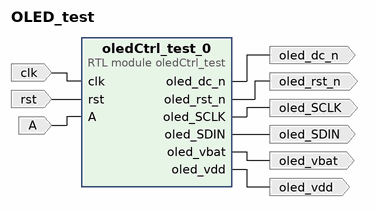
[diagram p0: block diagram of the top level]
# Vivado block design OLED_test, xc7z020clg484-1, Vivado 2020.2
create_bd_design OLED_test

create_bd_port -dir I -type clk clk
create_bd_port -dir I -type rst rst
create_bd_port -dir I A
create_bd_port -dir O oled_SCLK
create_bd_port -dir O oled_SDIN
create_bd_port -dir O oled_dc_n
create_bd_port -dir O -type rst oled_rst_n
create_bd_port -dir O oled_vbat
create_bd_port -dir O oled_vdd

create_bd_cell -type module -reference oledCtrl_test oledCtrl_test_0

# ---- connections ----

connect_bd_net -net clk_0_1 [get_bd_ports clk] [get_bd_pins oledCtrl_test_0/clk]
connect_bd_net -net rst_0_1 [get_bd_ports rst] [get_bd_pins oledCtrl_test_0/rst]
connect_bd_net -net A_0_1 [get_bd_ports A] [get_bd_pins oledCtrl_test_0/A]
connect_bd_net [get_bd_pins oledCtrl_test_0/oled_SCLK] [get_bd_ports oled_SCLK]
connect_bd_net [get_bd_pins oledCtrl_test_0/oled_SDIN] [get_bd_ports oled_SDIN]
connect_bd_net [get_bd_pins oledCtrl_test_0/oled_dc_n] [get_bd_ports oled_dc_n]
connect_bd_net [get_bd_pins oledCtrl_test_0/oled_rst_n] [get_bd_ports oled_rst_n]
connect_bd_net [get_bd_pins oledCtrl_test_0/oled_vbat] [get_bd_ports oled_vbat]
connect_bd_net [get_bd_pins oledCtrl_test_0/oled_vdd] [get_bd_ports oled_vdd]

validate_bd_design
save_bd_design
